# Altium schematic sheet p3_keypad_encoder_led.SchDoc
size A2; Organization: Protel International P/L; Address1: L3, 12a Rodborough Rd; Address2: Frenchs Forest; Address3: NSW; Address4: Australia 2086
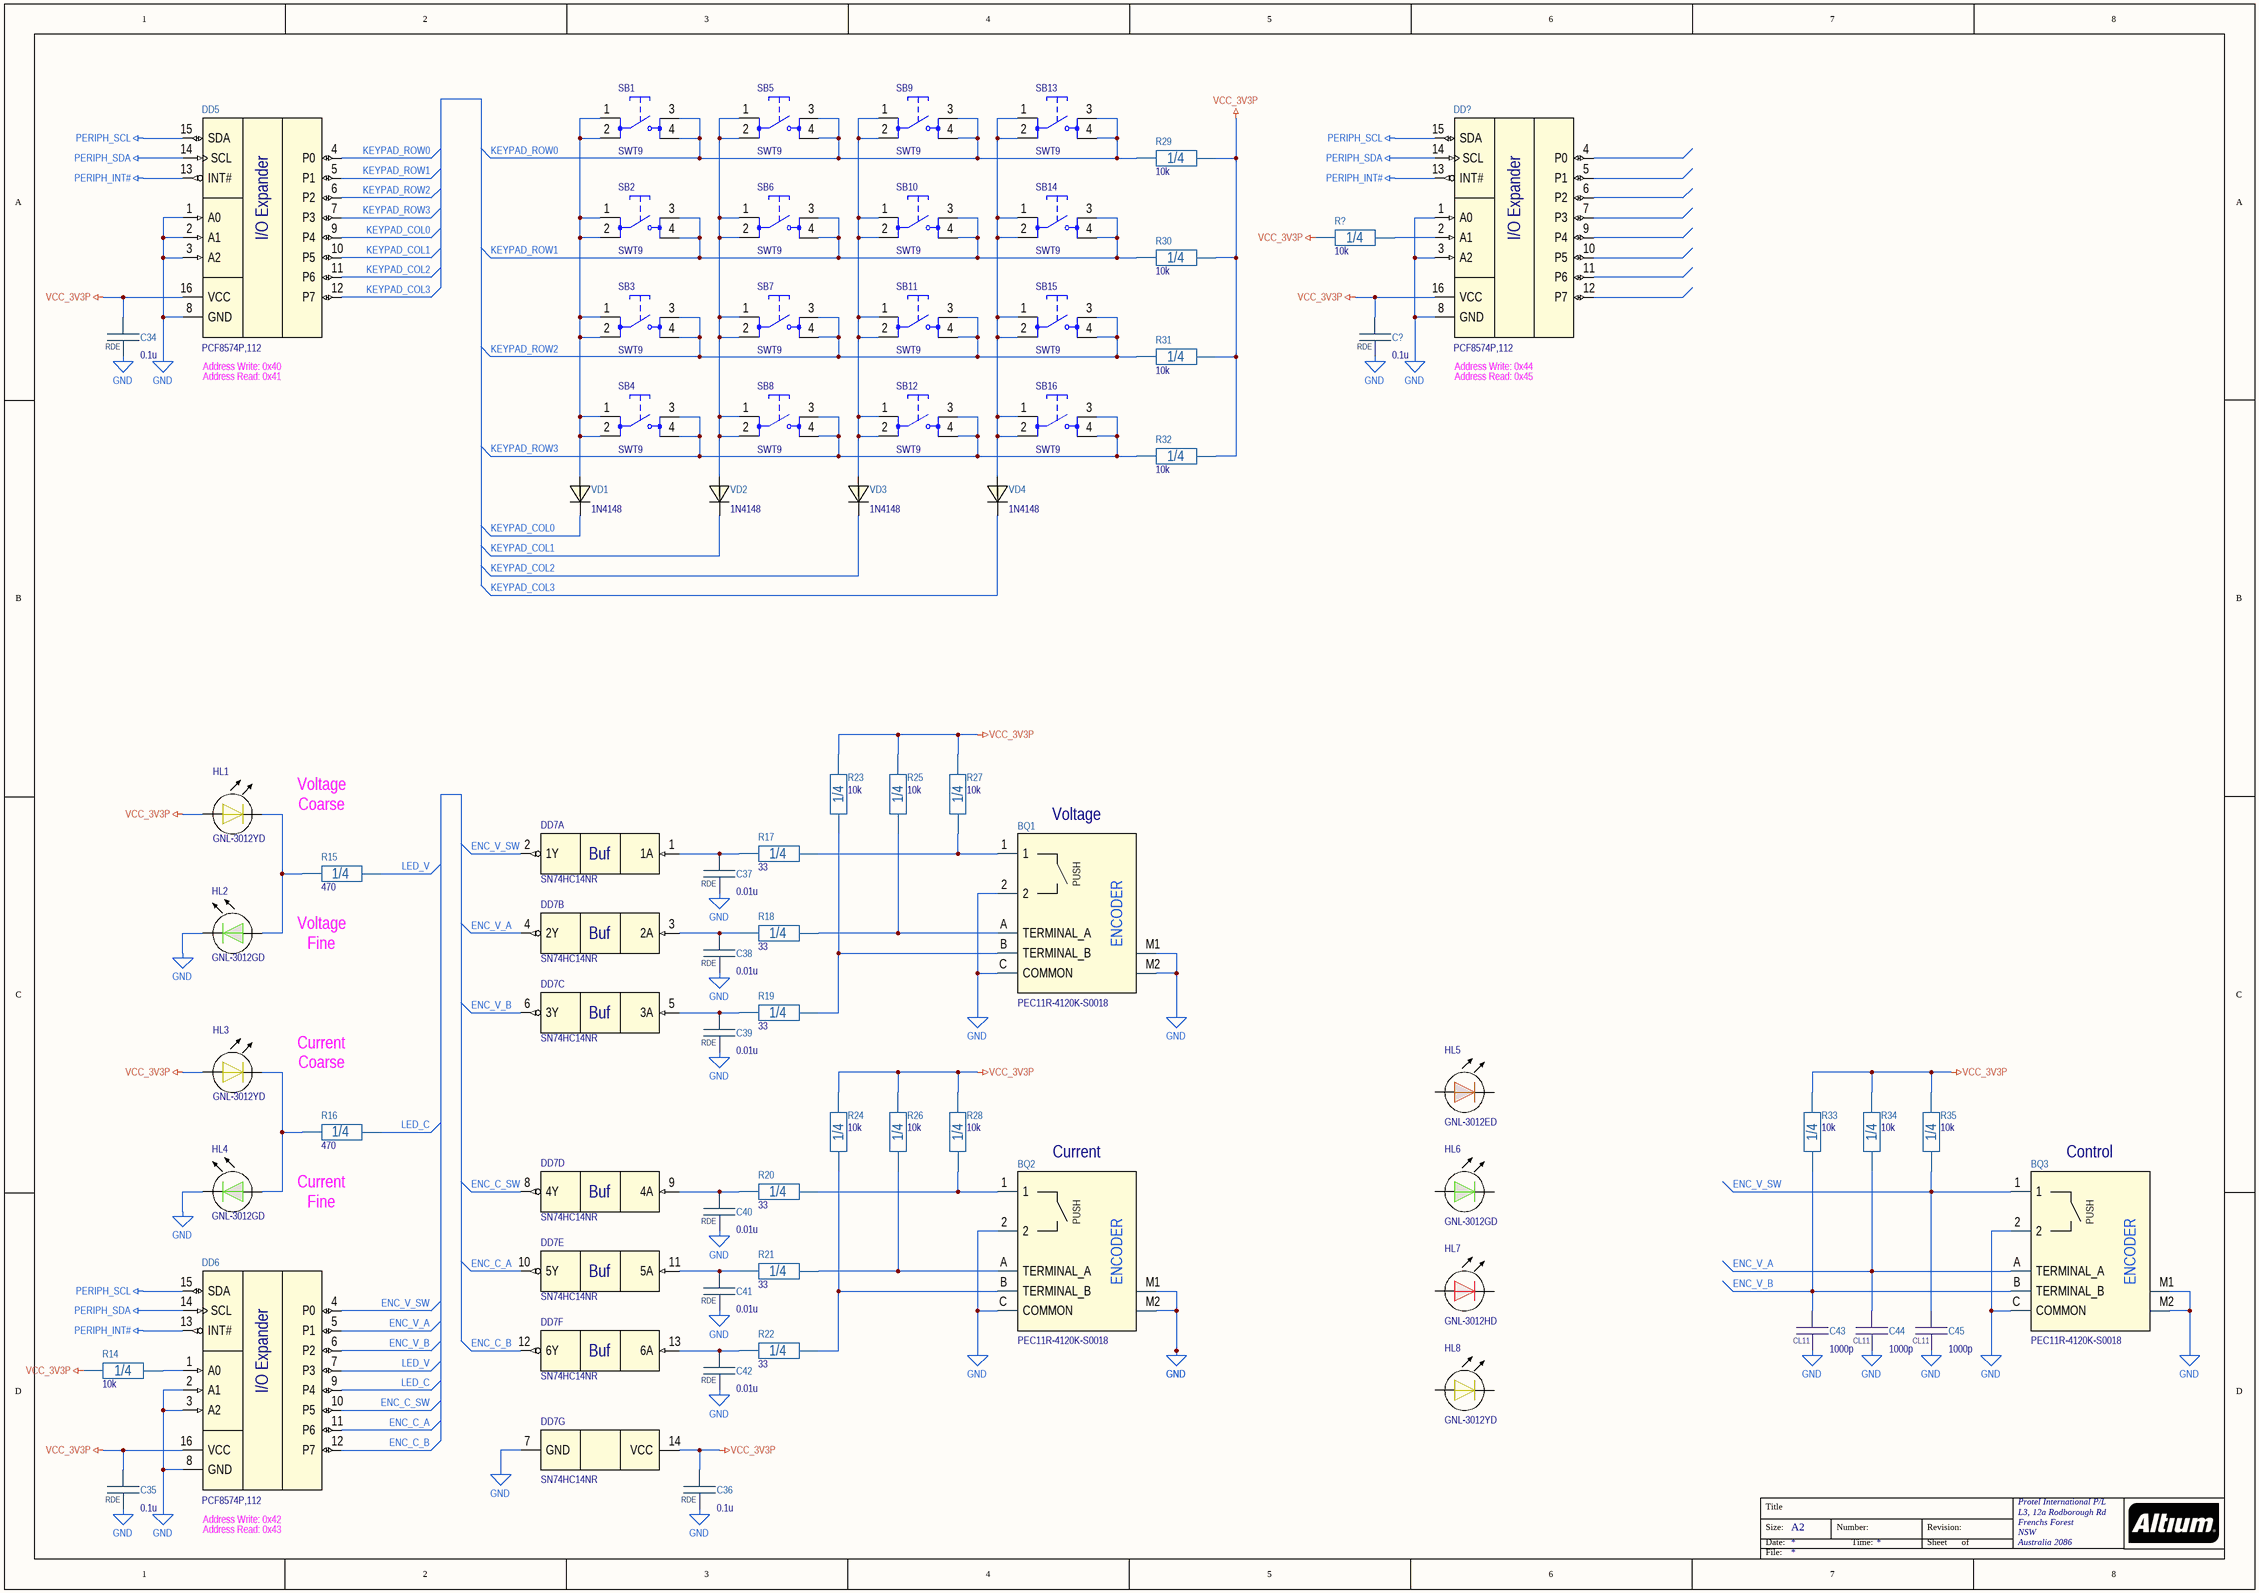
[diagram p0: p3_keypad_encoder_led.SchDoc]

## Parts
BQ1  PEC11R-4120K-S0018  [PEC11R-4120K-S0018]
BQ2  PEC11R-4120K-S0018  [PEC11R-4120K-S0018]
BQ3  PEC11R-4120K-S0018  [PEC11R-4120K-S0018]
C34  0.1u  Package: RDE  [RDE_1P1]
C35  0.1u  Package: RDE  [RDE_1P1]
C36  0.1u  Package: RDE  [RDE_1P1]
C37  0.01u  Package: RDE  [RDE_1P1]
C38  0.01u  Package: RDE  [RDE_1P1]
C39  0.01u  Package: RDE  [RDE_1P1]
C40  0.01u  Package: RDE  [RDE_1P1]
C41  0.01u  Package: RDE  [RDE_1P1]
C42  0.01u  Package: RDE  [RDE_1P1]
C43  1000p  [CL11_6x3.5_P3.5]
C44  1000p  [CL11_6x3.5_P3.5]
C45  1000p  [CL11_6x3.5_P3.5]
C?  0.1u  Package: RDE  [RDE_1P1]
DD5  PCF8574P,112  [DIP-16P-M03]
DD6  PCF8574P,112  [DIP-16P-M03]
DD7  SN74HC14NR  [DIP-14P-M02]  (parts A,B,C,D,E,F,G of 7)
DD?  PCF8574P,112  [DIP-16P-M03]
HL1  GNL-3012YD  [GNL-3012YD]
HL2  GNL-3012GD  [GNL-3012GD]
HL3  GNL-3012YD  [GNL-3012YD]
HL4  GNL-3012GD  [GNL-3012GD]
HL5  GNL-3012ED  [GNL-3012ED]
HL6  GNL-3012GD  [GNL-3012GD]
HL7  GNL-3012HD  [GNL-3012HD]
HL8  GNL-3012YD  [GNL-3012YD]
R14  10k  Package: 1/4  [CFR-25]
R15  470  Package: 1/4  [CFR-25]
R16  470  Package: 1/4  [CFR-25]
R17  33  Package: 1/4  [CFR-25]
R18  33  Package: 1/4  [CFR-25]
R19  33  Package: 1/4  [CFR-25]
R20  33  Package: 1/4  [CFR-25]
R21  33  Package: 1/4  [CFR-25]
R22  33  Package: 1/4  [CFR-25]
R23  10k  Package: 1/4  [CFR-25]
R24  10k  Package: 1/4  [CFR-25]
R25  10k  Package: 1/4  [CFR-25]
R26  10k  Package: 1/4  [CFR-25]
R27  10k  Package: 1/4  [CFR-25]
R28  10k  Package: 1/4  [CFR-25]
R29  10k  Package: 1/4  [CFR-25]
R30  10k  Package: 1/4  [CFR-25]
R31  10k  Package: 1/4  [CFR-25]
R32  10k  Package: 1/4  [CFR-25]
R33  10k  Package: 1/4  [CFR-25]
R34  10k  Package: 1/4  [CFR-25]
R35  10k  Package: 1/4  [CFR-25]
R?  10k  Package: 1/4  [CFR-25]
SB1  SWT9  [SWT9]
SB2  SWT9  [SWT9]
SB3  SWT9  [SWT9]
SB4  SWT9  [SWT9]
SB5  SWT9  [SWT9]
SB6  SWT9  [SWT9]
SB7  SWT9  [SWT9]
SB8  SWT9  [SWT9]
SB9  SWT9  [SWT9]
SB10  SWT9  [SWT9]
SB11  SWT9  [SWT9]
SB12  SWT9  [SWT9]
SB13  SWT9  [SWT9]
SB14  SWT9  [SWT9]
SB15  SWT9  [SWT9]
SB16  SWT9  [SWT9]
VD1  1N4148  [DO-35 GLASS LIGHT RED]
VD2  1N4148  [DO-35 GLASS LIGHT RED]
VD3  1N4148  [DO-35 GLASS LIGHT RED]
VD4  1N4148  [DO-35 GLASS LIGHT RED]

## Nets
GND: BQ1.2 BQ1.C(COMMON) BQ1.M1(MECHANICAL1) BQ1.M2(MECHANICAL2) BQ2.2 BQ2.C(COMMON) BQ2.M1(MECHANICAL1) BQ2.M2(MECHANICAL2) BQ3.2 BQ3.C(COMMON) BQ3.M1(MECHANICAL1) BQ3.M2(MECHANICAL2) C34.2 C35.2 C36.2 C37.2 C38.2 C39.2 C40.2 C41.2 C42.2 C43.1 C44.1 C45.1 C?.2 DD5.1(A0) DD5.2(A1) DD5.3(A2) DD5.8(GND) DD6.2(A1) DD6.3(A2) DD6.8(GND) DD7.7(GND) DD?.1(A0) DD?.3(A2) DD?.8(GND) HL2.1 HL4.1
PERIPH_INT#: DD5.13(INT#) DD6.13(INT#) DD?.13(INT#)
PERIPH_SCL: DD5.15(SDA) DD6.15(SDA) DD?.15(SDA)
PERIPH_SDA: DD5.14(SCL) DD6.14(SCL) DD?.14(SCL)
VCC_3V3P: C34.1 C35.1 C36.1 C?.1 DD5.16(VCC) DD6.16(VCC) DD7.14(VCC) DD?.16(VCC) HL1.2 HL3.2 R14.2 R23.2 R24.2 R25.2 R26.2 R27.2 R28.2 R29.1 R30.1 R31.1 R32.1 R33.2 R34.2 R35.2 R?.2
ENC_C_A: DD6.11(P6) DD7.10(5Y)
ENC_C_B: DD6.12(P7) DD7.12(6Y)
ENC_C_SW: DD6.10(P5) DD7.8(4Y)
ENC_V_A: BQ3.A(TERMINAL_A) C44.2 DD6.5(P1) DD7.4(2Y) R34.1
ENC_V_B: BQ3.B(TERMINAL_B) C43.2 DD6.6(P2) DD7.6(3Y) R33.1
ENC_V_SW: BQ3.1 C45.2 DD6.4(P0) DD7.2(1Y) R35.1
KEYPAD_COL0: DD5.9(P4) VD1.1
KEYPAD_COL1: DD5.10(P5) VD2.1
KEYPAD_COL2: DD5.11(P6) VD3.1
KEYPAD_COL3: DD5.12(P7) VD4.1
KEYPAD_ROW0: DD5.4(P0) R29.2 SB1.3 SB1.4 SB5.3 SB5.4 SB9.3 SB9.4 SB13.3 SB13.4
KEYPAD_ROW1: DD5.5(P1) R30.2 SB2.3 SB2.4 SB6.3 SB6.4 SB10.3 SB10.4 SB14.3 SB14.4
KEYPAD_ROW2: DD5.6(P2) R31.2 SB3.3 SB3.4 SB7.3 SB7.4 SB11.3 SB11.4 SB15.3 SB15.4
KEYPAD_ROW3: DD5.7(P3) R32.2 SB4.3 SB4.4 SB8.3 SB8.4 SB12.3 SB12.4 SB16.3 SB16.4
LED_C: DD6.9(P4) R16.1
LED_V: DD6.7(P3) R15.1
NetBQ1_1: BQ1.1 R17.1 R27.1
NetBQ1_A: BQ1.A(TERMINAL_A) R18.1 R25.1
NetBQ1_B: BQ1.B(TERMINAL_B) R19.1 R23.1
NetBQ2_1: BQ2.1 R20.1 R28.1
NetBQ2_A: BQ2.A(TERMINAL_A) R21.1 R26.1
NetBQ2_B: BQ2.B(TERMINAL_B) R22.1 R24.1
NetC37_1: C37.1 DD7.1(1A) R17.2
NetC38_1: C38.1 DD7.3(2A) R18.2
NetC39_1: C39.1 DD7.5(3A) R19.2
NetC40_1: C40.1 DD7.9(4A) R20.2
NetC41_1: C41.1 DD7.11(5A) R21.2
NetC42_1: C42.1 DD7.13(6A) R22.2
NetDD6_1: DD6.1(A0) R14.1
NetDD?_2: DD?.2(A1) R?.1
NetHL1_1: HL1.1 HL2.2 R15.2
NetHL3_1: HL3.1 HL4.2 R16.2
NetSB1_1: SB1.1 SB1.2 SB2.1 SB2.2 SB3.1 SB3.2 SB4.1 SB4.2 VD1.2
NetSB5_1: SB5.1 SB5.2 SB6.1 SB6.2 SB7.1 SB7.2 SB8.1 SB8.2 VD2.2
NetSB9_1: SB9.1 SB9.2 SB10.1 SB10.2 SB11.1 SB11.2 SB12.1 SB12.2 VD3.2
NetSB13_1: SB13.1 SB13.2 SB14.1 SB14.2 SB15.1 SB15.2 SB16.1 SB16.2 VD4.2

Not connected (* = marked no-connect by the designer): DD? 4(P0) 5(P1) 6(P2) 7(P3) 9(P4) 10(P5) 11(P6) 12(P7); HL5 1 2; HL6 1 2; HL7 1 2; HL8 1 2

## Notes on the sheet
- Address Write: 0x40
- Address Read: 0x41
- Address Write: 0x44
- Address Read: 0x45
- Voltage
- Coarse
- (near BQ1) Voltage
- Fine
- Current
- (near BQ2) Current
- (near BQ3) Control
- Address Write: 0x42
- Address Read: 0x43
- Title
- Size:
- Date:
- File:
- A2
- Number:
- Time:
- Revision:
- Sheet
- of
- (in symbol PCF8574P,112) I/O Expander
- (in symbol PEC11R-4120K-S0018) PUSH; ENCODER
- (in symbol SN74HC14NR, part A) Buf
- (in symbol SN74HC14NR, part B) Buf
- (in symbol SN74HC14NR, part C) Buf
- (in symbol SN74HC14NR, part D) Buf
- (in symbol SN74HC14NR, part E) Buf
- (in symbol SN74HC14NR, part F) Buf

## Library data of the parts
BQ1-BQ3 = PEC11R-4120K-S0018: 12 mm Incremental Encoder; Manufacturer: Bourns Inc.; Part Number: PEC11R-4120K-S0018
C34-C36 C? = RDE_CAP: MLCC radial lead type with epoxy coat (RDE Series); Part Number: RDER72A104K1P1H03B; Manufacturer: Murata; Tolerance: ± 10 %; Dielectric: X7R; Voltage: 100V; Value: 0.1u; Value on schem: 0.1u
C37-C42 = RDE_CAP: MLCC radial lead type with epoxy coat (RDE Series); Part Number: RDER71H103K; Manufacturer: Murata; Tolerance: ± 10 %; Dielectric: X7R; Voltage: 50V; Value: 0.01u; Value on schem: 0.01u
C43-C45 = CL11: CL11 Type Polyester Film Metal Foil Capacitor-inductive; Tolerance: ± 5 %; Voltage: 100V; Value: 1000p; Dielectric: Polyester; Value on schem: 1000p; Part Number: *; Manufacturer: *; Package: CL11
DD5 DD6 DD? = PCF8574P,112: Remote 8-bit I/O expander for I2C-bus; Manufacturer: NXP USA Inc.; Package: DIP-16; Part Number: PCF8574P,112
DD7 = SN74HC14NR: Hex Inverters with Schmitt-Trigger Inputs; Manufacturer: Texas Instruments; Part Number: SN74HC14NR; Package: DIP-14
HL1 HL3 HL8 = GNL-3012YD: Standard Brightness 3mm LED; Manufacturer: G-Nor Optoelectronics; Color: Yellow, 585 nm; Package: 3mm; Part Number: GNL-3012YD
HL2 HL4 HL6 = GNL-3012GD: Standard Brightness 3mm LED; Manufacturer: G-Nor Optoelectronics; Color: Green, 565 nm; Package: 3mm; Part Number: GNL-3012GD
HL5 = GNL-3012ED: Standard Brightness 3mm LED; Manufacturer: G-Nor Optoelectronics; Color: Orange, 635 nm; Package: 3mm; Part Number: GNL-3012ED
HL7 = GNL-3012HD: Standard Brightness 3mm LED; Manufacturer: G-Nor Optoelectronics; Color: Red, 700 nm; Package: 3mm; Part Number: GNL-3012HD
R14 R23-R35 R? = CF25: Resistor 1/4W; Part Number: MFR-25FTF52-10K; Manufacturer: Yageo; Tolerance: ± 1 %; Voltage: 250V; Temperature Coefficient: ±100 ppm/°C; Value: 10k; Value on schem: 10k
R15 R16 = CF25: Resistor 1/4W; Part Number: MFR-25FTF52-470R; Manufacturer: Yageo; Tolerance: ± 1 %; Voltage: 250V; Temperature Coefficient: ±100 ppm/°C; Value: 470; Value on schem: 470
R17-R22 = CF25: Resistor 1/4W; Part Number: MFR-25FTF52-33R; Manufacturer: Yageo; Tolerance: ± 1 %; Voltage: 250V; Temperature Coefficient: ±100 ppm/°C; Value: 33; Value on schem: 33
SB1-SB16 = SWT9: Tact Button (with tact cap SWT9S); Part Number: SWT9
VD1-VD4 = 1N4148: High-speed diode; Package: DO-35; Part Number: 1N4148